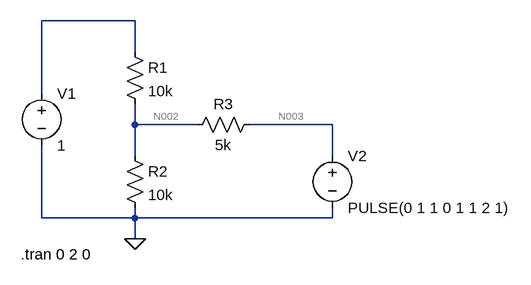
[diagram p0: schematic Hysteresis Feedback Resistors.asc]
Hysteresis Feedback Resistors.asc, the LTspice schematic file:
Version 4
SHEET 1 880 680
WIRE 48 32 -96 32
WIRE 48 80 48 32
WIRE -96 144 -96 32
WIRE 48 192 48 160
WIRE 144 192 48 192
WIRE 352 192 224 192
WIRE 48 240 48 192
WIRE 352 240 352 192
WIRE -96 336 -96 224
WIRE 48 336 48 320
WIRE 48 336 -96 336
WIRE 352 336 352 320
WIRE 352 336 48 336
WIRE 48 368 48 336
FLAG 48 368 0
SYMBOL res 32 64 R0
SYMATTR InstName R1
SYMATTR Value 10k
SYMBOL res 32 224 R0
SYMATTR InstName R2
SYMATTR Value 10k
SYMBOL res 240 176 R90
WINDOW 0 0 56 VBottom 2
WINDOW 3 32 56 VTop 2
SYMATTR InstName R3
SYMATTR Value 5k
SYMBOL voltage -96 128 R0
WINDOW 123 0 0 Left 0
WINDOW 39 0 0 Left 0
SYMATTR InstName V1
SYMATTR Value 1
SYMBOL voltage 352 224 R0
WINDOW 123 0 0 Left 0
WINDOW 39 0 0 Left 0
SYMATTR InstName V2
SYMATTR Value PULSE(0 1 1 0 1 1 2 1)
TEXT -128 392 Left 2 !.tran 0 2 0

The netlist it stands for:
* Hysteresis Feedback Resistors.asc
R1 N001 N002 10k
R2 N002 0 10k
R3 N003 N002 5k
V1 N001 0 1
V2 N003 0 PULSE(0 1 1 0 1 1 2 1)
.tran 0 2 0
.backanno
.end

* Results of the author's LTspice run, read from the files saved beside the schematic
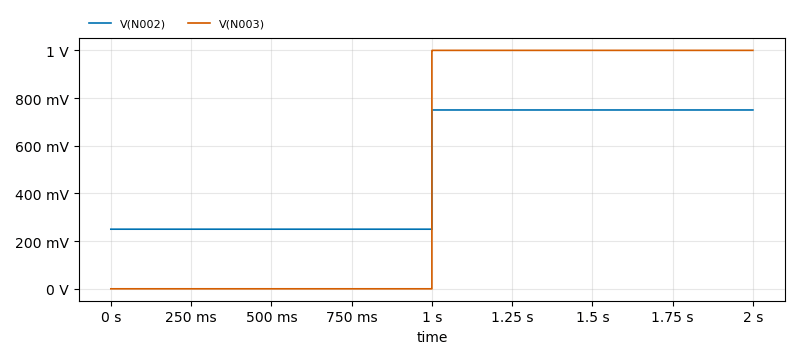
[diagram p1: Transient Analysis of Hysteresis Feedback Resistors.asc, plotted from the saved traces]
* Transient Analysis, 1 run:
*   V(N002): min 250 mV, max 750 mV, average 500 mV, rms 559 mV, last 750 mV
*   V(N003): min 0 V, max 1 V, average 500 mV, rms 707.1 mV, last 1 V